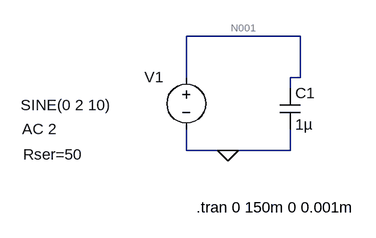
[diagram p0: schematic Draft1.asc]
Draft1.asc, the LTspice schematic file:
Version 4.1
SHEET 1 880 680
WIRE 224 64 48 64
WIRE 48 128 48 64
WIRE 224 128 224 64
WIRE 224 128 208 128
WIRE 208 144 208 128
WIRE 48 240 48 208
WIRE 112 240 48 240
WIRE 208 240 208 208
WIRE 208 240 112 240
FLAG 112 240 0
SYMBOL voltage 48 112 R0
WINDOW 0 -64 15 Left 2
WINDOW 3 -255 58 Left 2
WINDOW 123 -253 95 Left 2
WINDOW 39 -251 134 Left 2
SYMATTR InstName V1
SYMATTR Value SINE(0 2 10)
SYMATTR Value2 AC 2
SYMATTR SpiceLine Rser=50
SYMBOL cap 192 144 R0
SYMATTR InstName C1
SYMATTR Value 1µ
TEXT 64 328 Left 2 !.tran 0 150m 0 0.001m

The netlist it stands for:
* Draft1.asc
V1 N001 0 SINE(0 2 10) AC 2 Rser=50
C1 N001 0 1µ
.tran 0 150m 0 0.001m
.backanno
.end

* Results of the author's LTspice run, read from the files saved beside the schematic
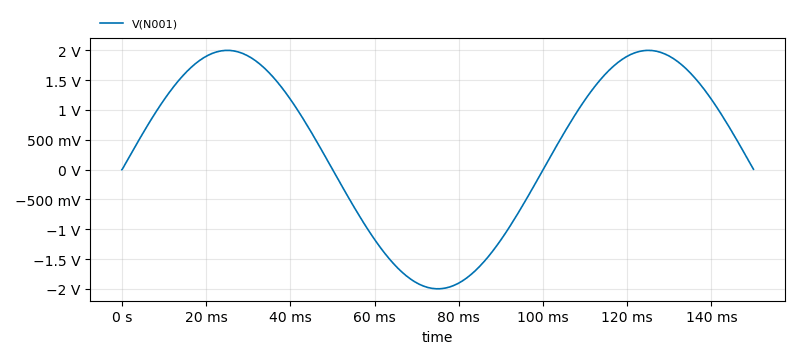
[diagram p1: Transient Analysis of Draft1.asc, plotted from the saved traces]
* Transient Analysis, 1 run:
*   V(N001): min -2 V, max 2 V, average 424.3 mV, rms 1.414 V, last 6.283 mV